# Altium schematic sheet Input circuits. Page 1.SchDoc
size 420 x 297 mm; Address1: Address1; Address2: Address2; Address3: Address3; Address4: Address4; DocumentNumber: АБВГ.123456.001 Э3; SheetNumber: 1; SheetTotal: 4; Scale: 1:1; DocumentType: Схема электрическая принципиальная; FirstReferrence: АБВГ.123456.001
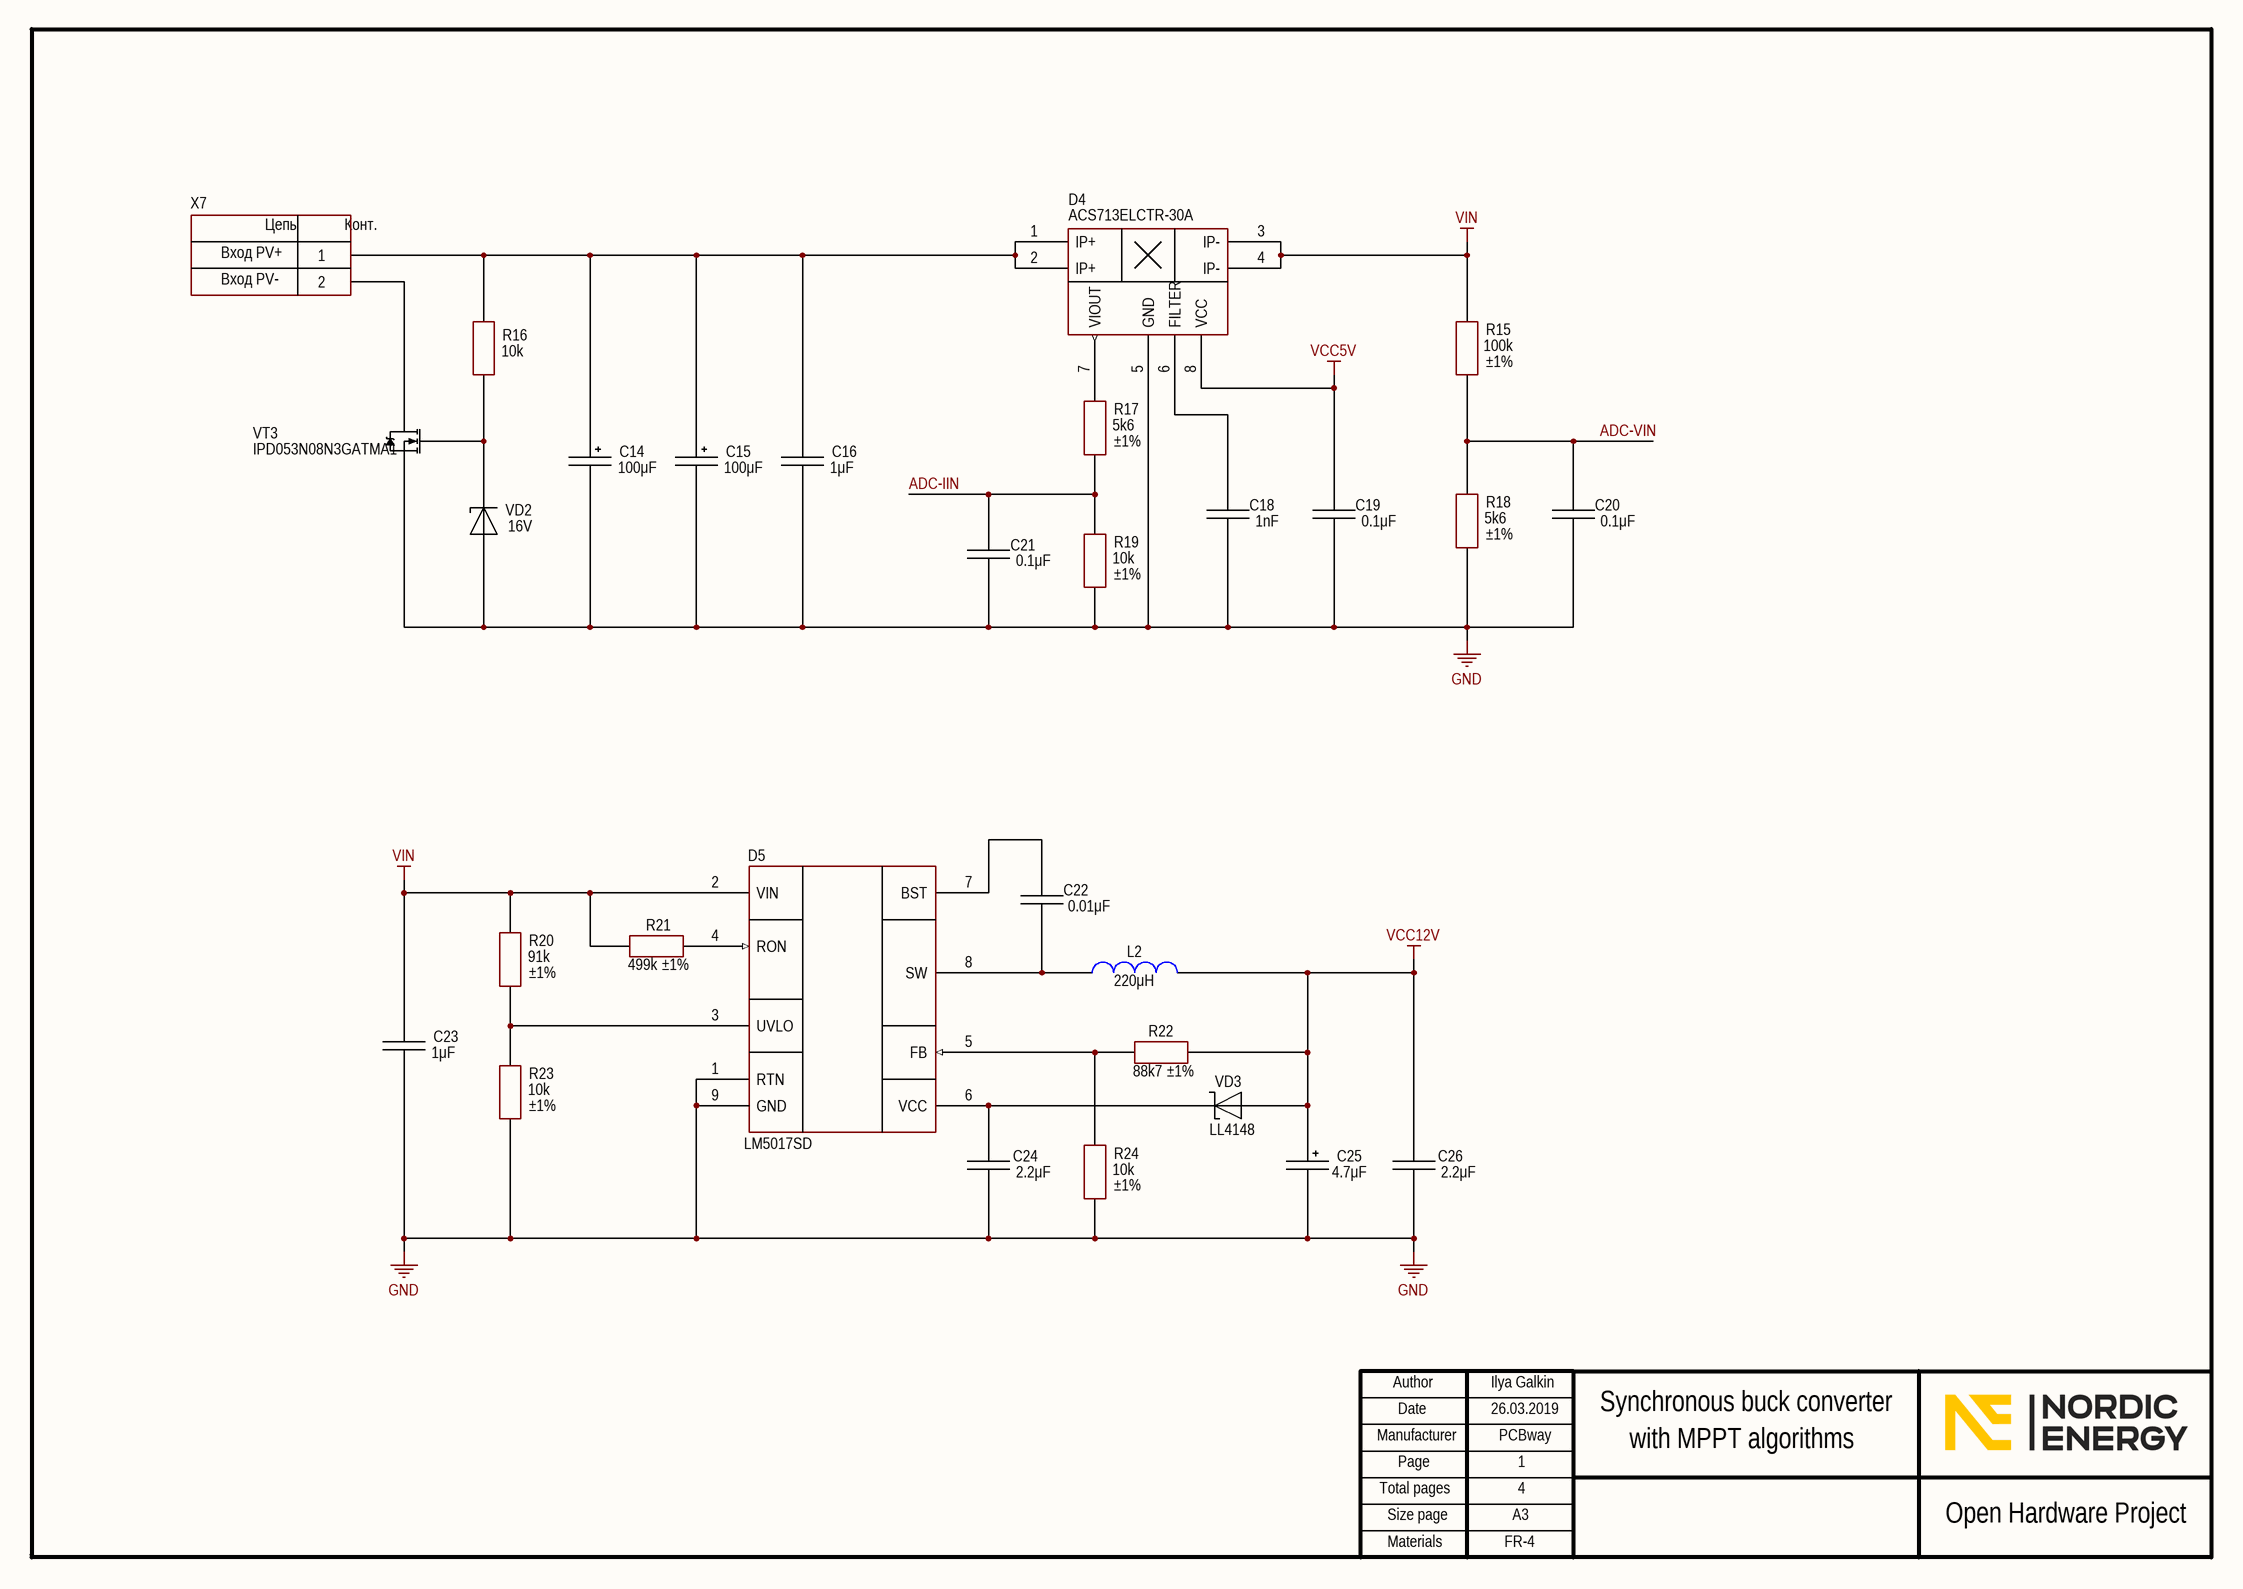
[diagram p0: Input circuits. Page 1.SchDoc]

## Parts
C14  100μF  [D10C5H12.5]
C15  100μF  [D10C5H12.5]
C16  1μF  [CH1206C]
C18  1nF  [CH0805C]
C19  0.1μF  [CH0805C]
C20  0.1μF  [CH0805C]
C21  0.1μF  [CH0805C]
C22  0.01μF  [CH0805C]
C23  1μF  [CH1206C]
C24  2.2μF  [CH0805C]
C25  4.7μF  [TANTAL_B]
C26  2.2μF  [CH0805C]
D4  ACS713ELCTR-30A  [8-SOIC]
D5  LM5017SD  [8-WDFN (4x4 mm)]
L2  220μH  [IND: SDR0805]
R15  100k  ComponentKind: ±1%  [CH0805R]
R16  10k  [CH0805R]
R17  5k6  ComponentKind: ±1%  [CH0805R]
R18  5k6  ComponentKind: ±1%  [CH0805R]
R19  10k  ComponentKind: ±1%  [CH0805R]
R20  91k  ComponentKind: ±1%  [CH0805R]
R21  499k  ComponentKind: ±1%  [CH0805R]
R22  88k7  ComponentKind: ±1%  [CH0805R]
R23  10k  ComponentKind: ±1%  [CH0805R]
R24  10k  ComponentKind: ±1%  [CH0805R]
VD2  16V  [SOD80]
VD3  LL4148  [SOD80]
VT3  IPD053N08N3GATMA1  [D2PAK]
X7  6PCV-02-006  [CON: 6PCV-02-006]  (value not drawn)

## Nets
GND: C14.2 C15.2 C16.2 C18.1 C19.1 C20.1 C21.1 C23.2 C24.1 C25.2 C26.1 D4.5(GND) D5.1(RTN) D5.9(GND) R18.1 R19.1 R23.1 R24.1 VD2.1(A) VT3.3(S)
VCC5V: C19.2 D4.8(VCC)
VCC12V: C25.1 C26.2 L2.1 R22.1 VD3.1
VIN: C23.1 D4.3(IP-) D4.4(IP-) D5.2(VIN) R15.2 R20.2 R21.2
ADC-IIN: C21.2 R17.1 R19.2
ADC-VIN: C20.2 R15.1 R18.2
NetC14_1: C14.1 C15.1 C16.1 D4.1(IP+) D4.2(IP+) R16.2 X7.1
NetC18_2: C18.2 D4.6(FILTER)
NetC22_1: C22.1 D5.8(SW) L2.2
NetC22_2: C22.2 D5.7(BST)
NetC24_2: C24.2 D5.6(VCC) VD3.2
NetD4_7: D4.7(VIOUT) R17.2
NetD5_3: D5.3(UVLO) R20.1 R23.2
NetD5_4: D5.4(RON) R21.1
NetD5_5: D5.5(FB) R22.2 R24.2
NetR16_1: R16.1 VD2.2(C) VT3.1(G)
NetVT3_2: VT3.2(D) X7.2

## Notes on the sheet
- Вход PV+
- Вход PV-
- Ilya Galkin
- 26.03.2019
- PCBway
- 1
- Synchronous buck converter
- with MPPT algorithms
- 4
- FR-4
- Author
- Manufacturer
- Date
- Page
- Total pages
- Size page
- A3
- Open Hardware Project
- Materials
- (in symbol 2-Connector) Цепь; Конт.

## Library data of the parts
C14 C15 = AlumCap: Manufacturer: Wurth; Model: 860010775014; HelpURL: https://www.digikey.com/product-detail/en/wurth-electronics-inc/860010775014/732-8771-1-ND/5728718; ComponentKind: 63V; Value: 100μF
C16 C23 = Capacitor: Manufacturer: Samsung; Model: CL31B105KCHSNNE; HelpURL: https://www.digikey.com/product-detail/en/samsung-electro-mechanics/CL31B105KCHSNNE/1276-2747-1-ND/3890833; ComponentKind: X7R; Value: 1μF
C18 = Capacitor: Manufacturer: Yageo; Model: CC0805KRX7R9BB102; HelpURL: https://www.digikey.com/product-detail/en/yageo/CC0805KRX7R9BB102/311-1127-1-ND/303037; ComponentKind: X7R; Value: 1nF
C19-C21 = Capacitor: Manufacturer: Yageo; Model: CC0805KRX7R8BB104; HelpURL: https://www.digikey.com/product-detail/en/yageo/CC0805KRX7R8BB104/311-1141-1-ND/303051; ComponentKind: X7R; Value: 0.1μF
C22 = Capacitor: Manufacturer: Yageo; Model: CC0805KRX7R9BB103; HelpURL: https://www.digikey.com/product-detail/en/yageo/CC0805KRX7R9BB103/311-1136-1-ND/303046; ComponentKind: X7R; Value: 0.01μF
C24 C26 = Capacitor: Manufacturer: Yageo; Model: CC0805KKX7R7BB225; HelpURL: https://www.digikey.com/product-detail/en/yageo/CC0805KKX7R7BB225/311-1881-1-ND/5195783; ComponentKind: X7R; Value: 2.2μF
C25 = TantalCap: Manufacturer: AVX; Model: TAJA475K025RNJ; HelpURL: https://www.digikey.com/product-detail/en/avx-corporation/TAJA475K025RNJ/478-11053-1-ND/7536161; ComponentKind: 25V; Value: 4.7μF
D4 = ACS713ELCTR-30A-T: Sensor; Manufacturer: Allegro MicroSystems, LLC; Model: ACS713ELCTR-30A-T; HelpURL: https://www.digikey.com/product-detail/en/allegro-microsystems-llc/ACS713ELCTR-30A-T/620-1193-1-ND/1284610; ComponentKind: 8-SOIC
D5 = LM5017SD: Step-down; Manufacturer: Texas Instruments; Model: LM5017SD/NOPB; HelpURL: https://www.digikey.com/product-detail/en/texas-instruments/LM5017SD-NOPB/LM5017SD-NOPBCT-ND/3137455; ComponentKind: 8-WDFN
L2 = Inductor: Manufacturer: Bourns; Model: SDR0805-221KL; HelpURL: https://www.digikey.com/product-detail/en/bourns-inc/SDR0805-221KL/SDR0805-221KLCT-ND/2127164; ComponentKind: 490mA; Value: 220μH
R15 = Resistor: Manufacturer: Yageo; Model: RC0805FR-07100KL; HelpURL: https://www.digikey.com/product-detail/en/yageo/RC0805FR-07100KL/311-100KCRCT-ND/730491; Value: 100k
R16 = Resistor: Manufacturer: Yageo; Model: RC0805JR-0710KL; HelpURL: https://www.digikey.com/product-detail/en/yageo/RC0805JR-0710KL/311-10KARCT-ND/731188; ComponentKind: ±5%; Value: 10k
R17 R18 = Resistor: Manufacturer: Yageo; Model: RC0805FR-075K6L; HelpURL: https://www.digikey.com/product-detail/en/yageo/RC0805FR-075K6L/311-5.60KCRCT-ND/730949; Value: 5k6
R19 R23 R24 = Resistor: Manufacturer: Yageo; Model: RC0805FR-0710KL; HelpURL: https://www.digikey.com/product-detail/en/yageo/RC0805FR-0710KL/311-10.0KCRCT-ND/730482; Value: 10k
R20 = Resistor: Manufacturer: Yageo; Model: RC0805FR-0791KL; HelpURL: https://www.digikey.com/product-detail/en/yageo/RC0805FR-0791KL/311-91.0KCRCT-ND/731149; Value: 91k
R21 = Resistor: Manufacturer: Yageo; Model: RC0805FR-07499KL; HelpURL: https://www.digikey.com/product-detail/en/yageo/RC0805FR-07499KL/311-499KCRCT-ND/730934; Value: 499k
R22 = Resistor: Manufacturer: Yageo; Model: RC0805FR-0788K7L; HelpURL: https://www.digikey.com/product-detail/en/yageo/RC0805FR-0788K7L/311-88.7KCRCT-ND/731128; Value: 88k7
VD2 = Diod Zener: Manufacturer: Central Semiconductor; Model: CLL5246B TR; ComponentKind: 16V; HelpURL: https://www.digikey.com/product-detail/en/central-semiconductor-corp/CLL5246B-TR/CLL5246BCT-ND/5324392
VD3 = Diod Schottky: Manufacturer: ON Semiconductor; ComponentKind: 100V; Model: LL4148; HelpURL: https://www.digikey.com/product-detail/en/on-semiconductor/LL4148/LL4148FSCT-ND/1923118
VT3 = N-chanel: Mosfet; Manufacturer: Infineon; Model: IPD053N08N3GATMA1; ComponentKind: 80V; HelpURL: https://www.digikey.com/product-detail/en/infineon-technologies/IPD053N08N3GATMA1/IPD053N08N3GATMA1CT-ND/5353500
X7 = 2-Connector: Manufacturer: TE Connectivity; Model: 6PCV-02-006; HelpURL: https://www.digikey.com/products/en?keywords=6pcv-02-006; ComponentKind: 25A